# Altium project Main.PrjPcb
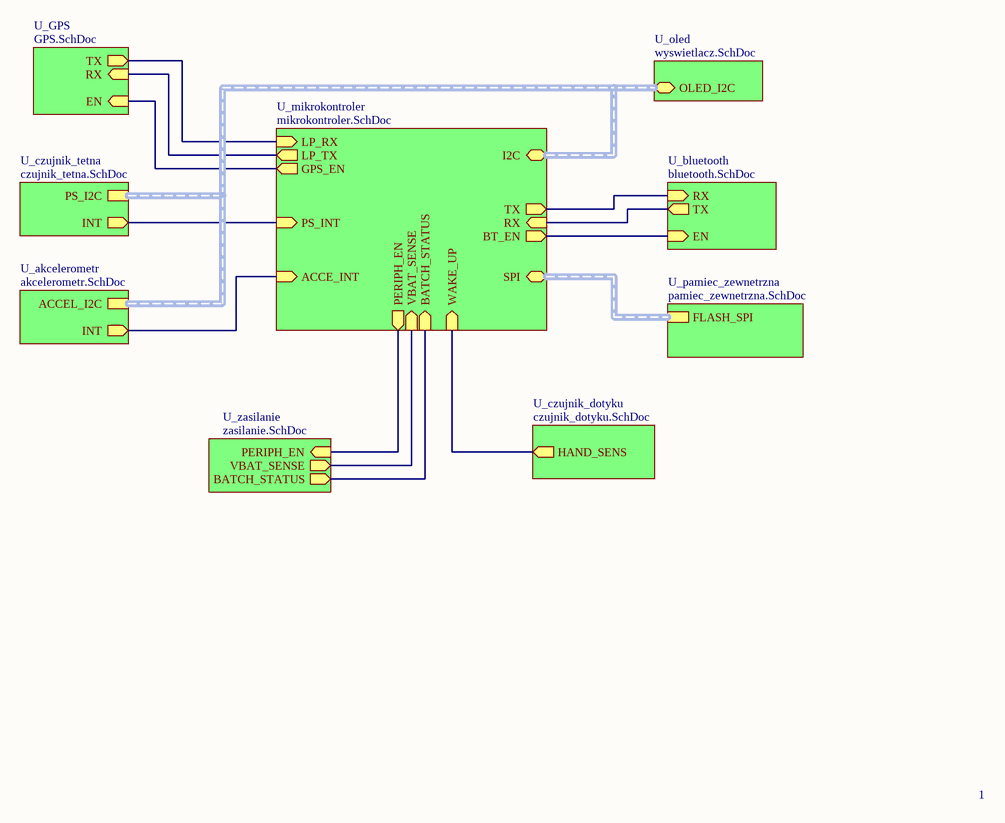
[diagram p0: schemat_blokowy.SchDoc]
ProjectAuthor: Grzegorz Œwistak
10 sheets, 51 parts. Net scope: hierarchical (ports join the sheet entries above them; power ports are global).
Board file: board.PcbDoc
Sheets:
  schemat_blokowy.SchDoc
    U_bluetooth = bluetooth.SchDoc
    U_czujnik_tetna = czujnik_tetna.SchDoc
    U_akcelerometr = akcelerometr.SchDoc
    U_pamiec_zewnetrzna = pamiec_zewnetrzna.SchDoc
    U_czujnik_dotyku = czujnik_dotyku.SchDoc
    U_zasilanie = zasilanie.SchDoc
    U_mikrokontroler = mikrokontroler.SchDoc
    U_GPS = GPS.SchDoc
    U_oled = wyswietlacz.SchDoc

## Sheet schemat_blokowy.SchDoc: Block diagram
size A4

### Sub-sheets
U_akcelerometr = akcelerometr.SchDoc: ACCEL_I2C (harness I2C), INT (out)
U_bluetooth = bluetooth.SchDoc: TX (out), RX (in), EN (in)
U_czujnik_dotyku = czujnik_dotyku.SchDoc: HAND_SENS (out)
U_czujnik_tetna = czujnik_tetna.SchDoc: PS_I2C (harness I2C), INT (out)
U_GPS = GPS.SchDoc: RX (in), TX (out), EN (in)
U_mikrokontroler = mikrokontroler.SchDoc: SPI (harness SPI), I2C (harness I2C), ACCE_INT (in), WAKE_UP (in), LP_TX (out), LP_RX (in), TX (out), RX (in), PS_INT (in), BT_EN (out), GPS_EN (out), PERIPH_EN (out), VBAT_SENSE (in), BATCH_STATUS (in)
U_oled = wyswietlacz.SchDoc: OLED_I2C (harness I2C)
U_pamiec_zewnetrzna = pamiec_zewnetrzna.SchDoc: FLASH_SPI (harness SPI)
U_zasilanie = zasilanie.SchDoc: PERIPH_EN (in), VBAT_SENSE (out), BATCH_STATUS (out)

### Nets
NetC12_2: sheet U_zasilanie/VBAT_SENSE, sheet U_mikrokontroler/VBAT_SENSE
NetIC1_13: sheet U_czujnik_tetna/INT, sheet U_mikrokontroler/PS_INT
NetIC2_1: sheet U_czujnik_dotyku/HAND_SENS, sheet U_mikrokontroler/WAKE_UP
NetIC3_20: sheet U_mikrokontroler/LP_RX, sheet U_GPS/TX
NetIC3_21: sheet U_mikrokontroler/LP_TX, sheet U_GPS/RX
NetIC5_1: sheet U_zasilanie/BATCH_STATUS, sheet U_mikrokontroler/BATCH_STATUS
NetIC8_7: sheet U_mikrokontroler/GPS_EN, sheet U_GPS/EN
NetIC8_15: sheet U_akcelerometr/INT, sheet U_mikrokontroler/ACCE_INT
NetIC8_22: sheet U_zasilanie/PERIPH_EN, sheet U_mikrokontroler/PERIPH_EN
NetIC8_26: sheet U_bluetooth/EN, sheet U_mikrokontroler/BT_EN
NetIC8_29: sheet U_bluetooth/RX, sheet U_mikrokontroler/TX
NetIC8_30: sheet U_bluetooth/TX, sheet U_mikrokontroler/RX

### Buses and harness runs
harness sheet U_akcelerometr/ACCEL_I2C = sheet U_czujnik_tetna/PS_I2C = sheet U_mikrokontroler/I2C = sheet U_oled/OLED_I2C
harness sheet U_mikrokontroler/SPI = sheet U_pamiec_zewnetrzna/FLASH_SPI

### Notes on the sheet
- 1

## Sheet bluetooth.SchDoc: Bluetooth
size A4
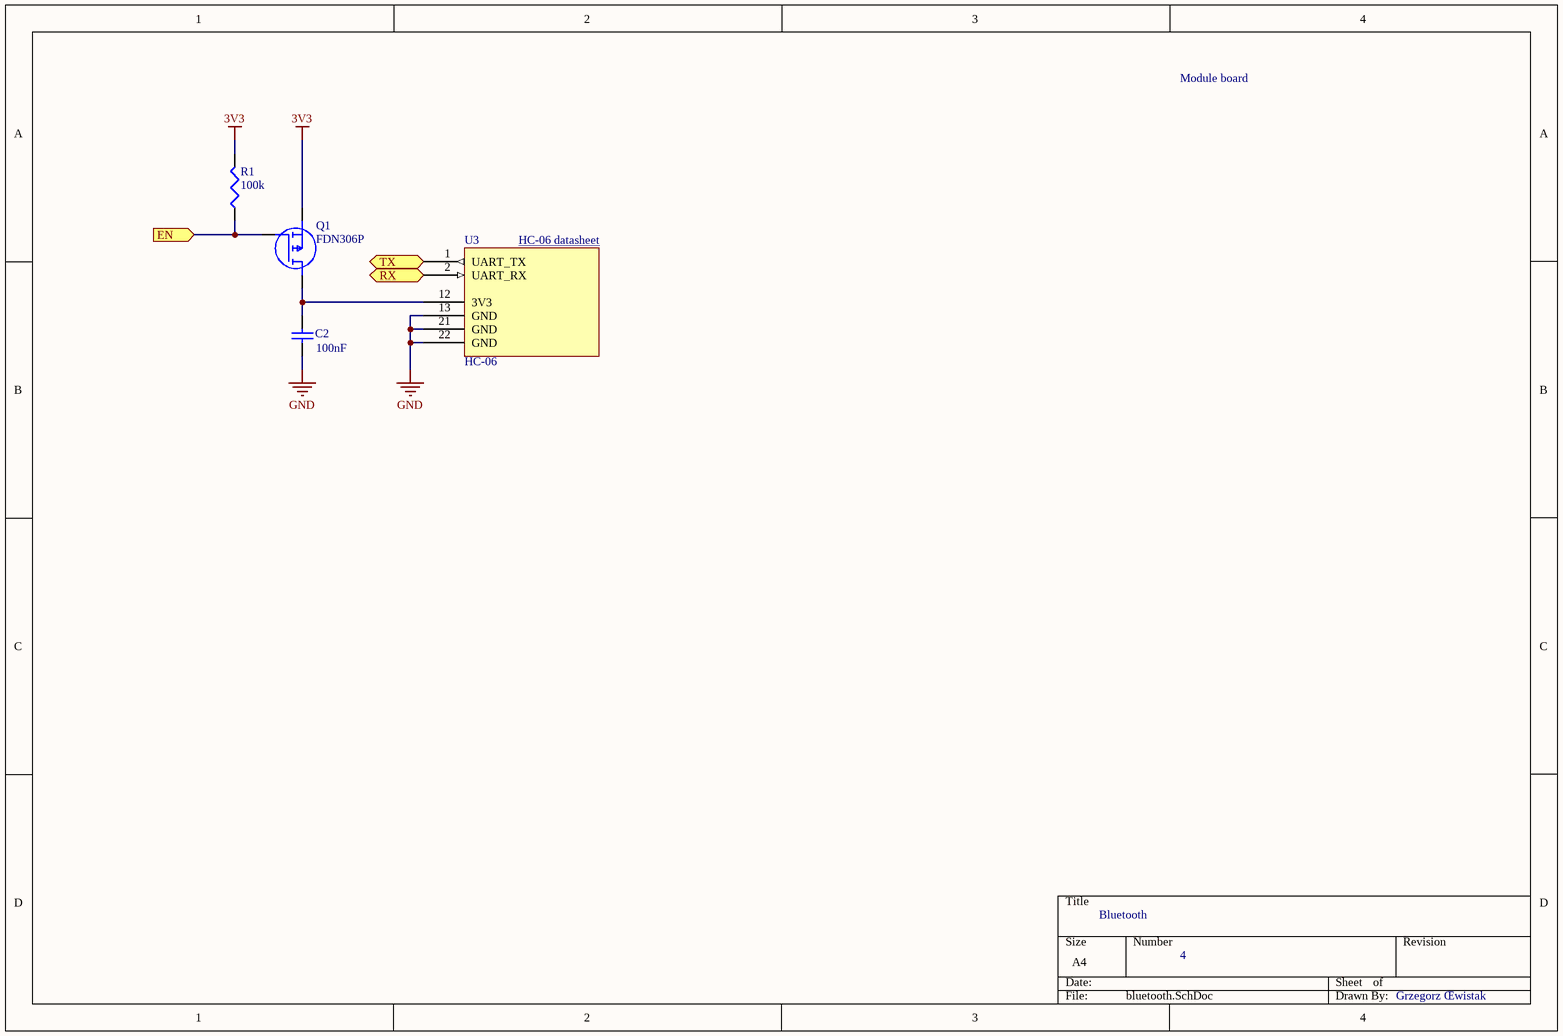
[diagram p1: bluetooth.SchDoc]

### Parts
C2  value 100nF  [C0805]  (hidden comment: Cap)
Q1  FDN306P  [SOT95P237X112-3N]
R1  value 100k  [R0603]  (hidden comment: Res3)
U3  HC-06  [HC-06_footprint_minimal_pin_number]

### Ports
EN (in), RX (in), TX (out)

### Nets
3V3: Q1.2(S) R1.2
GND: C2.1 U3.13(GND) U3.21(GND) U3.22(GND)
NetC2_2: C2.2 Q1.3(D) U3.12(3V3)
NetIC8_26: Q1.1(G) R1.1 ; port EN
NetIC8_29: U3.2(UART_RX) ; port RX
NetIC8_30: U3.1(UART_TX) ; port TX

### Notes on the sheet
- Module board
- HC-06 datasheet <https://www.olimex.com/Products/Components/RF/BLUETOOTH-SERIAL-HC-06/resources/hc06.pdf>
- 4

### Library data of the parts
C2 = Cap: Capacitor; Published: 8-Jun-2000; LatestRevisionDate: 17-Jul-2002; LatestRevisionNote: Re-released for DXP Platform.; PackageReference: RAD-0.3; Publisher: Altium Limited; PackageDescription: Radial Cap, Thru-Hole; 2 Leads; 0.3 in Pin Spacing
Q1 = FDN306P: MOSFET (P-Channel); Manufacturer_Name: ON Semiconductor; Datasheet Link: http://uk.rs-online.com/web/p/products/1241702; Height: 1.12mm; Manufacturer_Part_Number: FDN306P; Arrow Part Number: FDN306P; Arrow Price/Stock: https://www.arrow.com/en/products/fdn306p/on-semiconductor; Mouser Part Number: 512-FDN306P; Mouser Price/Stock: https://www.mouser.co.uk/ProductDetail/ON-Semiconductor-Fairchild/FDN306P?qs=GeD7q9OHBPy9Kkc110idSQ%3D%3D
R1 = Res3: Resistor; Published: 8-Jun-2000; LatestRevisionDate: 29-May-2009; LatestRevisionNote: IPC-7351 Footprint Added.; PackageReference: J1-0603; Publisher: Altium Limited; PackageDescription: Chip Resistor
U3 = HC-06: HC-06 bluetooth module

## Sheet czujnik_tetna.SchDoc: Czujnik tętna
size A4; DrawnBy: Grzegorz Świstak; SheetNumber: 1
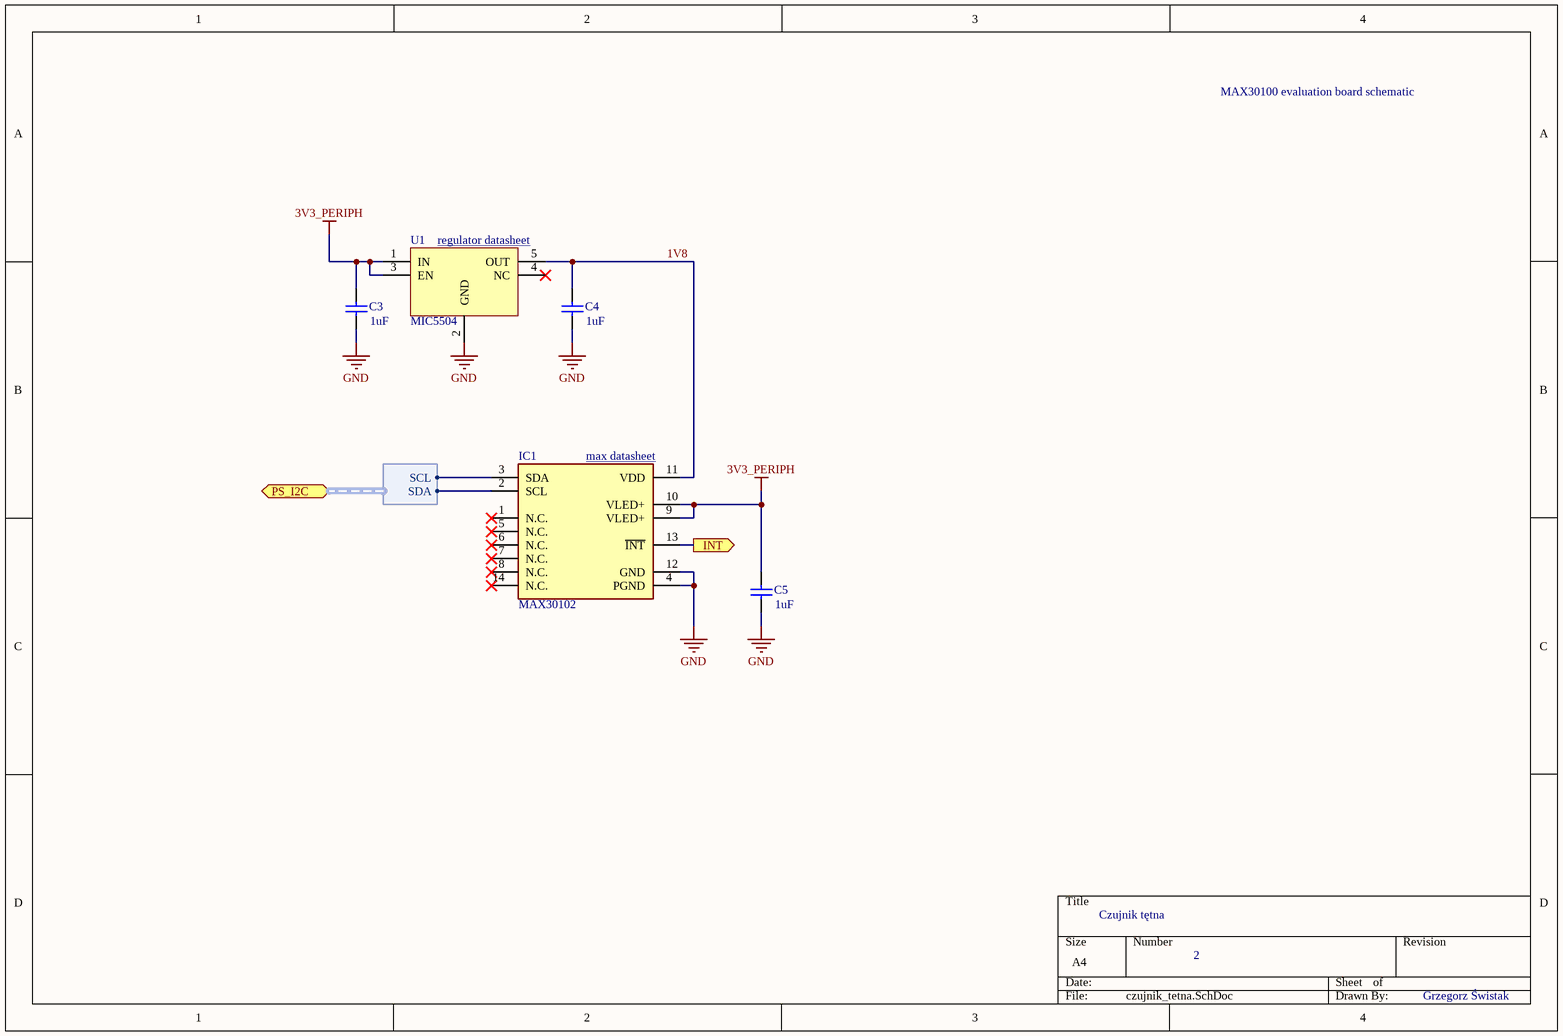
[diagram p2: czujnik_tetna.SchDoc]

### Parts
C3  value 1uF  [cap-0603]  (hidden comment: Cap)
C4  value 1uF  [cap-0603]  (hidden comment: Cap)
C5  value 1uF  [cap-0603]  (hidden comment: Cap)
IC1  MAX30102  [MAX30102EFDT]
U1  MIC5504  [SOT23-5]

### Ports
INT (out), PS_I2C (harness I2C)

### Harnesses
I2C: SDA, SCL

### Nets
3V3_PERIPH: C3.2 C5.2 IC1.9(VLED+) IC1.10(VLED+) U1.1(IN) U1.3(EN)
GND: C3.1 C4.1 C5.1 IC1.4(PGND) IC1.12(GND) U1.2(GND)
1V8: C4.2 IC1.11(VDD) U1.5(OUT)
I2C.SCL: IC1.3(SDA) ; port PS_I2C.SCL
I2C.SDA: IC1.2(SCL) ; port PS_I2C.SDA
NetIC1_13: IC1.13(~{INT}) ; port INT

Not connected (* = marked no-connect by the designer): IC1 1(N.C.)* 5(N.C.)* 6(N.C.)* 7(N.C.)* 8(N.C.)* 14(N.C.)*; U1 4(NC)*

### Notes on the sheet
- MAX30100 evaluation board schematic
- (near U1) regulator datasheet <http://ww1.microchip.com/downloads/en/DeviceDoc/MIC5501-02-03-04-300mA-Single-Output-LDO-in-Small-Packages-DS20006006B.pdf>
- (near IC1) max datasheet <https://datasheets.maximintegrated.com/en/ds/MAX30102.pdf>
- 2

### Library data of the parts
C3-C5 = Cap: Capacitor; Published: 8-Jun-2000; LatestRevisionDate: 17-Jul-2002; LatestRevisionNote: Re-released for DXP Platform.; PackageReference: RAD-0.3; Publisher: Altium Limited; PackageDescription: Radial Cap, Thru-Hole; 2 Leads; 0.3 in Pin Spacing
IC1 = MAX30102EFD+T: https://datasheets.maximintegrated.com/en/ds/MAX30102.pdf; Datasheet Link: https://datasheets.maximintegrated.com/en/ds/MAX30102.pdf; Height: 1.65mm; Manufacturer_Name: Maxim Integrated; Manufacturer_Part_Number: MAX30102EFD+T; Arrow Part Number: MAX30102EFD+T; Mouser Part Number: 700-MAX30102EFD+T; Mouser Price/Stock: https://www.mouser.co.uk/ProductDetail/Maxim-Integrated/MAX30102EFD%2bT?qs=nVS1qgv%252BQrkHA4%2FoFYriFA%3D%3D
U1 = MIC5504: http://ww1.microchip.com/downloads/en/DeviceDoc/21813F.pdf

## Sheet akcelerometr.SchDoc: Akcelerometer
size A4
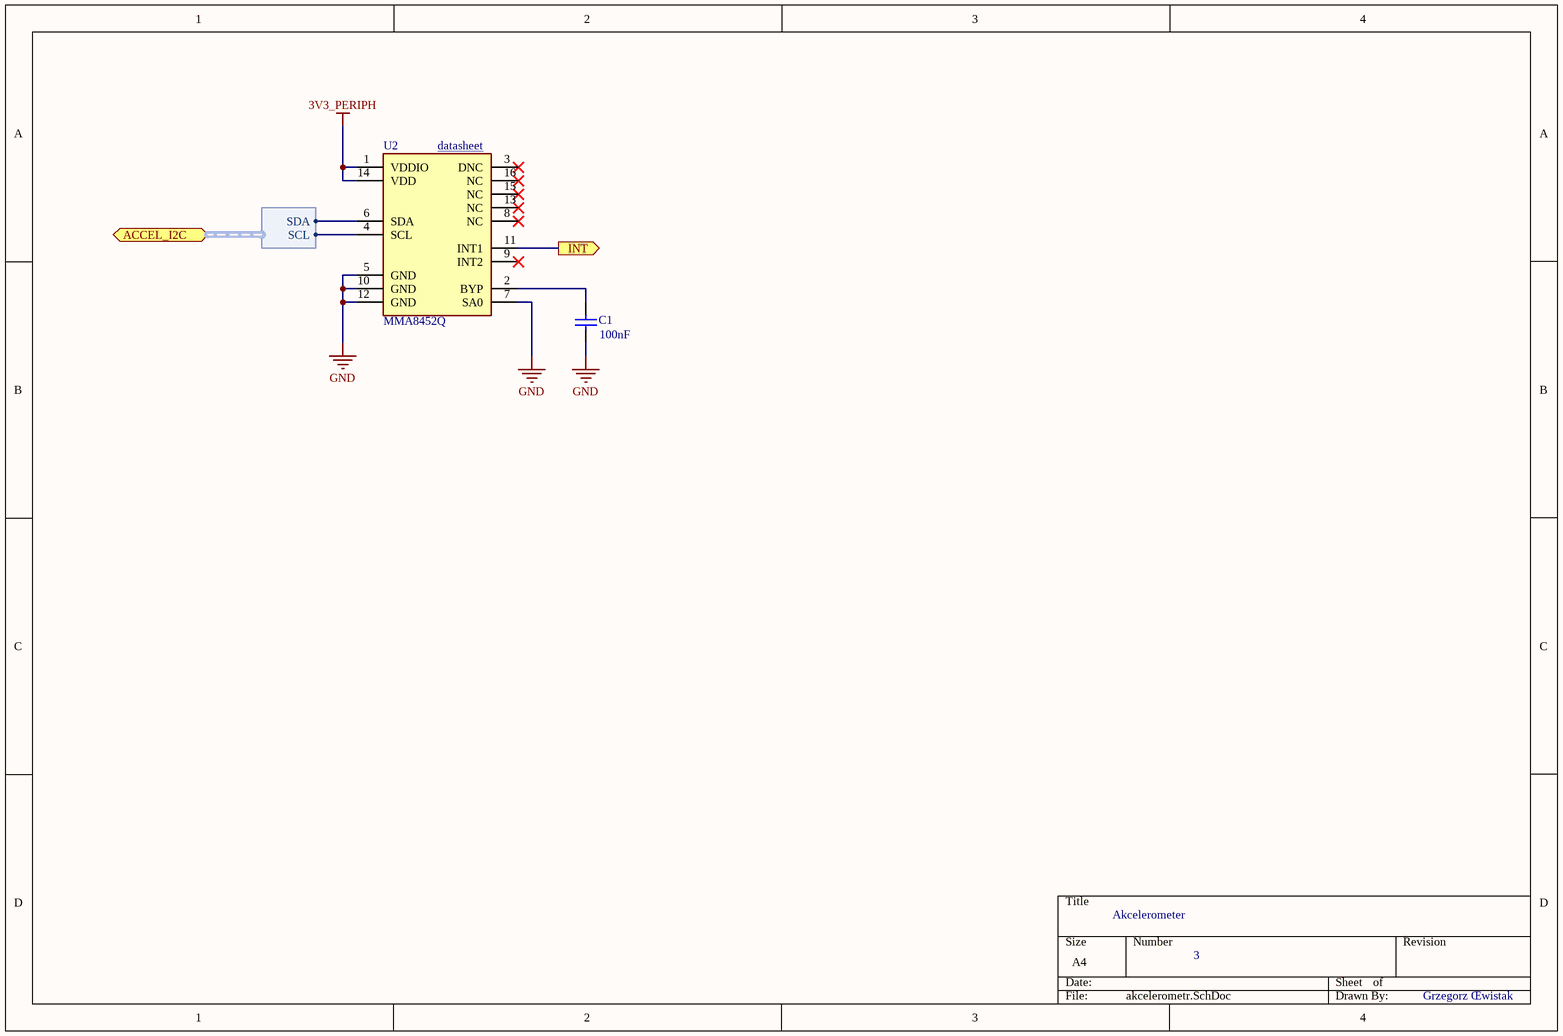
[diagram p3: akcelerometr.SchDoc]

### Parts
C1  value 100nF  [C0805]  (hidden comment: Cap)
U2  MMA8452Q  [QFN-16]

### Ports
ACCEL_I2C (harness I2C), INT (out)

### Harnesses
I2C: SDA, SCL

### Nets
3V3_PERIPH: U2.1(VDDIO) U2.14(VDD)
GND: C1.1 U2.5(GND) U2.7(SA0) U2.10(GND) U2.12(GND)
I2C.SCL: U2.4(SCL) ; port ACCEL_I2C.SCL
I2C.SDA: U2.6(SDA) ; port ACCEL_I2C.SDA
NetC1_2: C1.2 U2.2(BYP)
NetIC8_15: U2.11(INT1) ; port INT

Not connected (* = marked no-connect by the designer): U2 3(DNC)* 8(NC)* 9(INT2)* 13(NC)* 15(NC)* 16(NC)*

### Notes on the sheet
- (near U2) datasheet <https://www.tme.eu/Document/9ec5aa089751e59cf0a8343add08639a/MMA8452Q.pdf>
- 3

### Library data of the parts
C1 = Cap: Capacitor; Published: 8-Jun-2000; LatestRevisionDate: 17-Jul-2002; LatestRevisionNote: Re-released for DXP Platform.; PackageReference: RAD-0.3; Publisher: Altium Limited; PackageDescription: Radial Cap, Thru-Hole; 2 Leads; 0.3 in Pin Spacing
U2 = MMA8452QR1: Accelerometer; Manufacturer_Name: NXP; Datasheet Link: http://www.nxp.com/docs/en/data-sheet/MMA8452Q.pdf; Height: 1mm; Manufacturer_Part_Number: MMA8452QR1; Arrow Part Number: MMA8452QR1; Arrow Price/Stock: https://www.arrow.com/en/products/mma8452qr1/nxp-semiconductors; Mouser Part Number: 841-MMA8452QR1; Mouser Price/Stock: https://www.mouser.co.uk/ProductDetail/NXP-Semiconductors/MMA8452QR1?qs=nf24X8JpkflP9lEXYucw7A%3D%3D

## Sheet pamiec_zewnetrzna.SchDoc: Flash memory
size A4
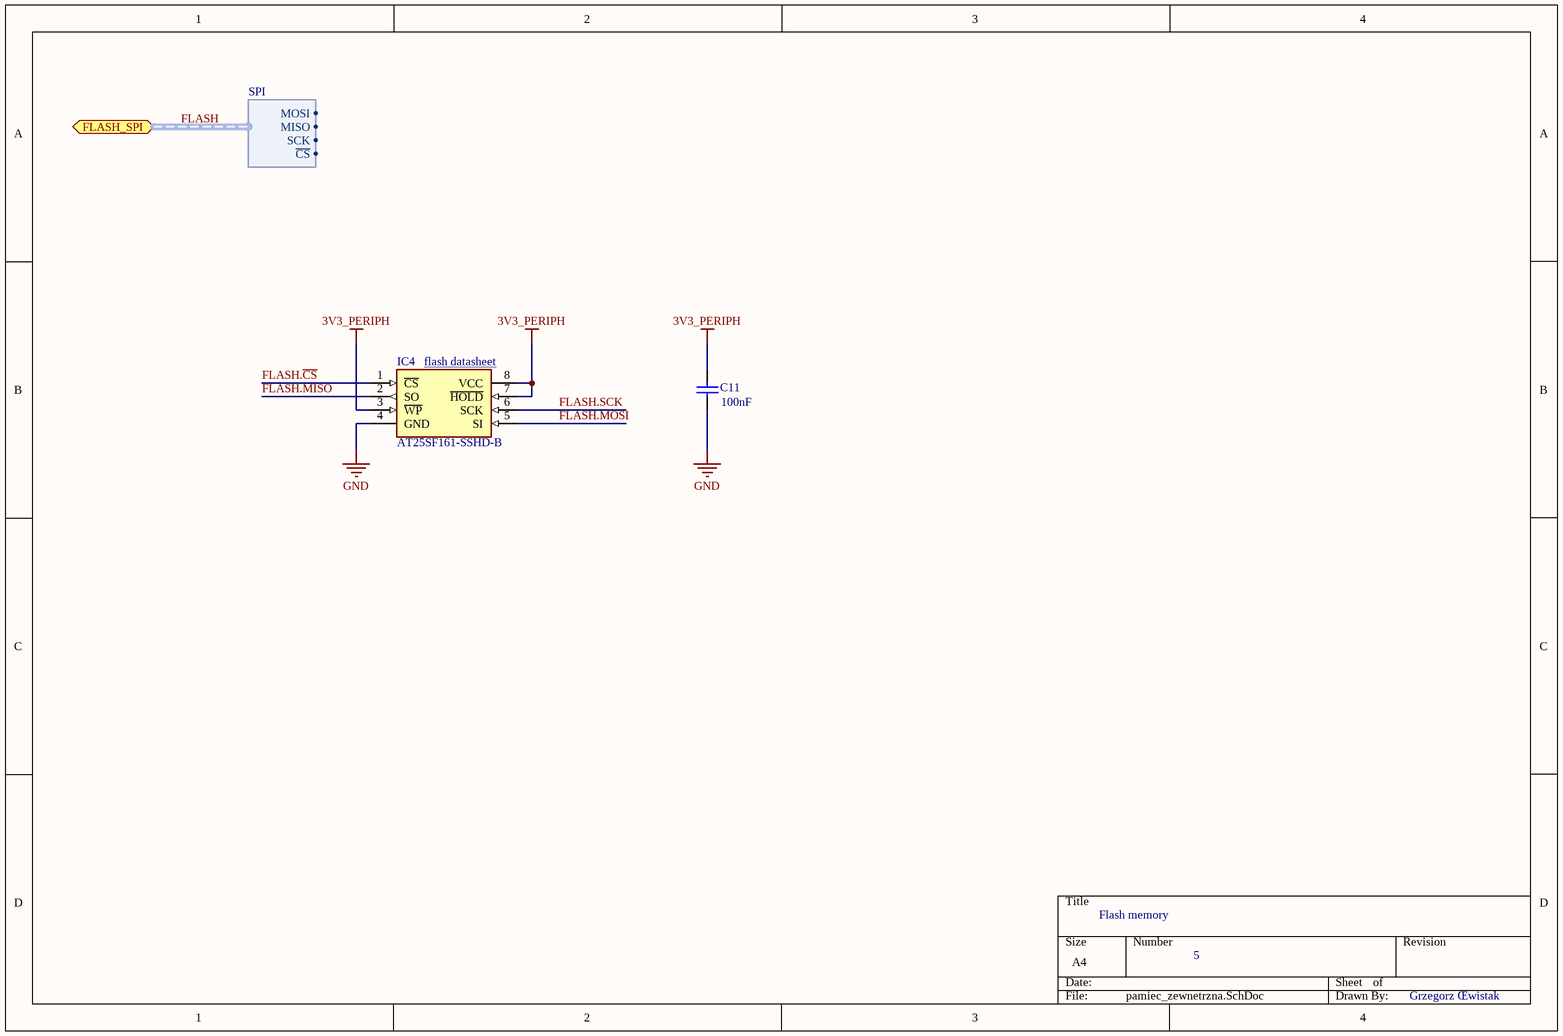
[diagram p4: pamiec_zewnetrzna.SchDoc]

### Parts
C11  value 100nF  [C0805]  (hidden comment: Cap)
IC4  AT25SF161-SSHD-B  [SOIC127P600X175-8N]

### Ports
FLASH_SPI (harness SPI)

### Harnesses
SPI: MOSI, MISO, SCK, ~{CS}

### Nets
3V3_PERIPH: C11.2 IC4.3(~{WP}) IC4.7(~{HOLD}) IC4.8(VCC)
GND: C11.1 IC4.4(GND)
FLASH.~{CS}: IC4.1(~{CS})
FLASH.MISO: IC4.2(SO)
FLASH.MOSI: IC4.5(SI)
FLASH.SCK: IC4.6(SCK)

### Buses and harness runs
harness FLASH = port FLASH_SPI

### Notes on the sheet
- (near IC4) flash datasheet <https://www.adestotech.com/wp-content/uploads/DS-AT25SF081_045.pdf>
- 5

### Library data of the parts
C11 = Cap: Capacitor; Published: 8-Jun-2000; LatestRevisionDate: 17-Jul-2002; LatestRevisionNote: Re-released for DXP Platform.; PackageReference: RAD-0.3; Publisher: Altium Limited; PackageDescription: Radial Cap, Thru-Hole; 2 Leads; 0.3 in Pin Spacing
IC4 = AT25SF081-SSHD-B: flash memory SPI; Manufacturer_Name: Adesto Technologies; Datasheet Link: https://www.mouser.com/datasheet/2/590/DS-AT25SF081_045-1385733.pdf; Height: 1.75mm; Manufacturer_Part_Number: AT25SF081-SSHD-B; Arrow Part Number: AT25SF081-SSHD-B; Arrow Price/Stock: https://www.arrow.com/en/products/at25sf081-sshd-b/adesto-technologies-corporation-inc; Mouser Part Number: 988-AT25SF081-SSHD-B; Mouser Price/Stock: https://www.mouser.com/Search/Refine.aspx?Keyword=988-AT25SF081-SSHD-B

## Sheet czujnik_dotyku.SchDoc: Touch sensor
size A4
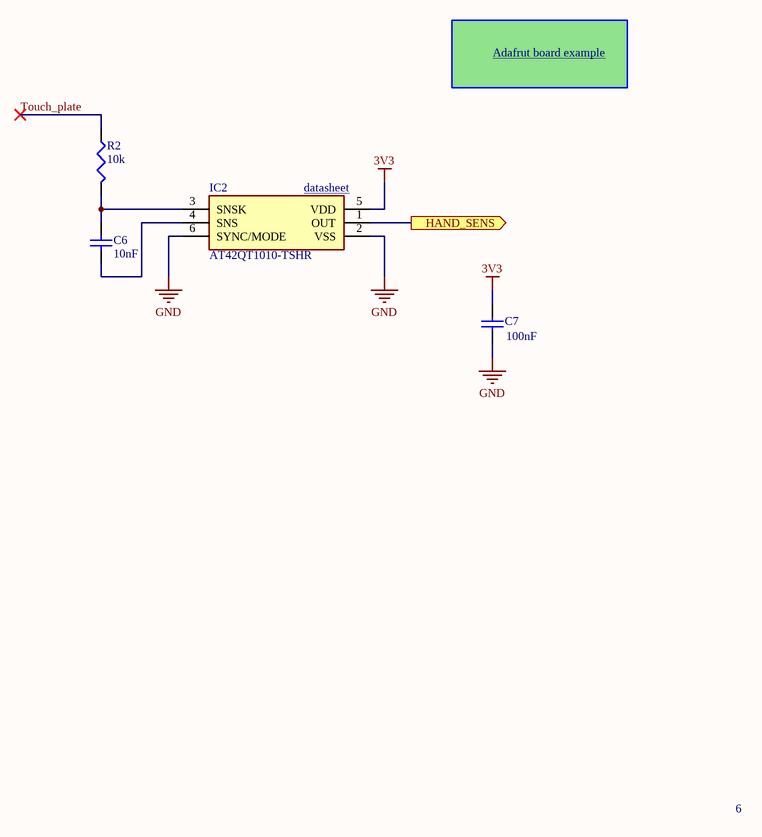
[diagram p5: czujnik_dotyku.SchDoc]

### Parts
C6  value 10nF  [C0805]  (hidden comment: Cap)
C7  value 100nF  [C0805]  (hidden comment: Cap)
IC2  AT42QT1010-TSHR  [SOT95P280X145-6N]
R2  value 10k  [R0603]  (hidden comment: Res3)

### Ports
HAND_SENS (out)

### Nets
3V3: C7.2 IC2.5(VDD)
GND: C7.1 IC2.2(VSS) IC2.6(SYNC/MODE)
Touch_plate: R2.2
NetC6_1: C6.1 IC2.4(SNS)
NetC6_2: C6.2 IC2.3(SNSK) R2.1
NetIC2_1: IC2.1(OUT) ; port HAND_SENS

### Notes on the sheet
- Adafrut board example <https://learn.adafruit.com/adafruit-capacitive-touch-sensor-breakouts/downloads>
- (near IC2) datasheet <https://cdn-shop.adafruit.com/datasheets/AT42QT1010.pdf>
- 6

### Library data of the parts
C6 C7 = Cap: Capacitor; Published: 8-Jun-2000; LatestRevisionDate: 17-Jul-2002; LatestRevisionNote: Re-released for DXP Platform.; PackageReference: RAD-0.3; Publisher: Altium Limited; PackageDescription: Radial Cap, Thru-Hole; 2 Leads; 0.3 in Pin Spacing
IC2 = AT42QT1010-TSHR: capacitive touch sensor; Manufacturer_Name: Microchip; Datasheet Link: http://www.atmel.com/images/atmel-9541-at42-qtouch-bsw-at42qt1010_datasheet.pdf; Height: 1.45mm; Manufacturer_Part_Number: AT42QT1010-TSHR; Arrow Part Number: AT42QT1010-TSHR; Arrow Price/Stock: https://www.arrow.com/en/products/at42qt1010-tshr/microchip-technology; Mouser Part Number: 556-AT42QT1010-TSHR; Mouser Price/Stock: https://www.mouser.co.uk/ProductDetail/Microchip-Technology/AT42QT1010-TSHR?qs=xbJoyvfFV%2F%252BFK88JVR2efg%3D%3D
R2 = Res3: Resistor; Published: 8-Jun-2000; LatestRevisionDate: 29-May-2009; LatestRevisionNote: IPC-7351 Footprint Added.; PackageReference: J1-0603; Publisher: Altium Limited; PackageDescription: Chip Resistor

## Sheet zasilanie.SchDoc: Power supply
size A4
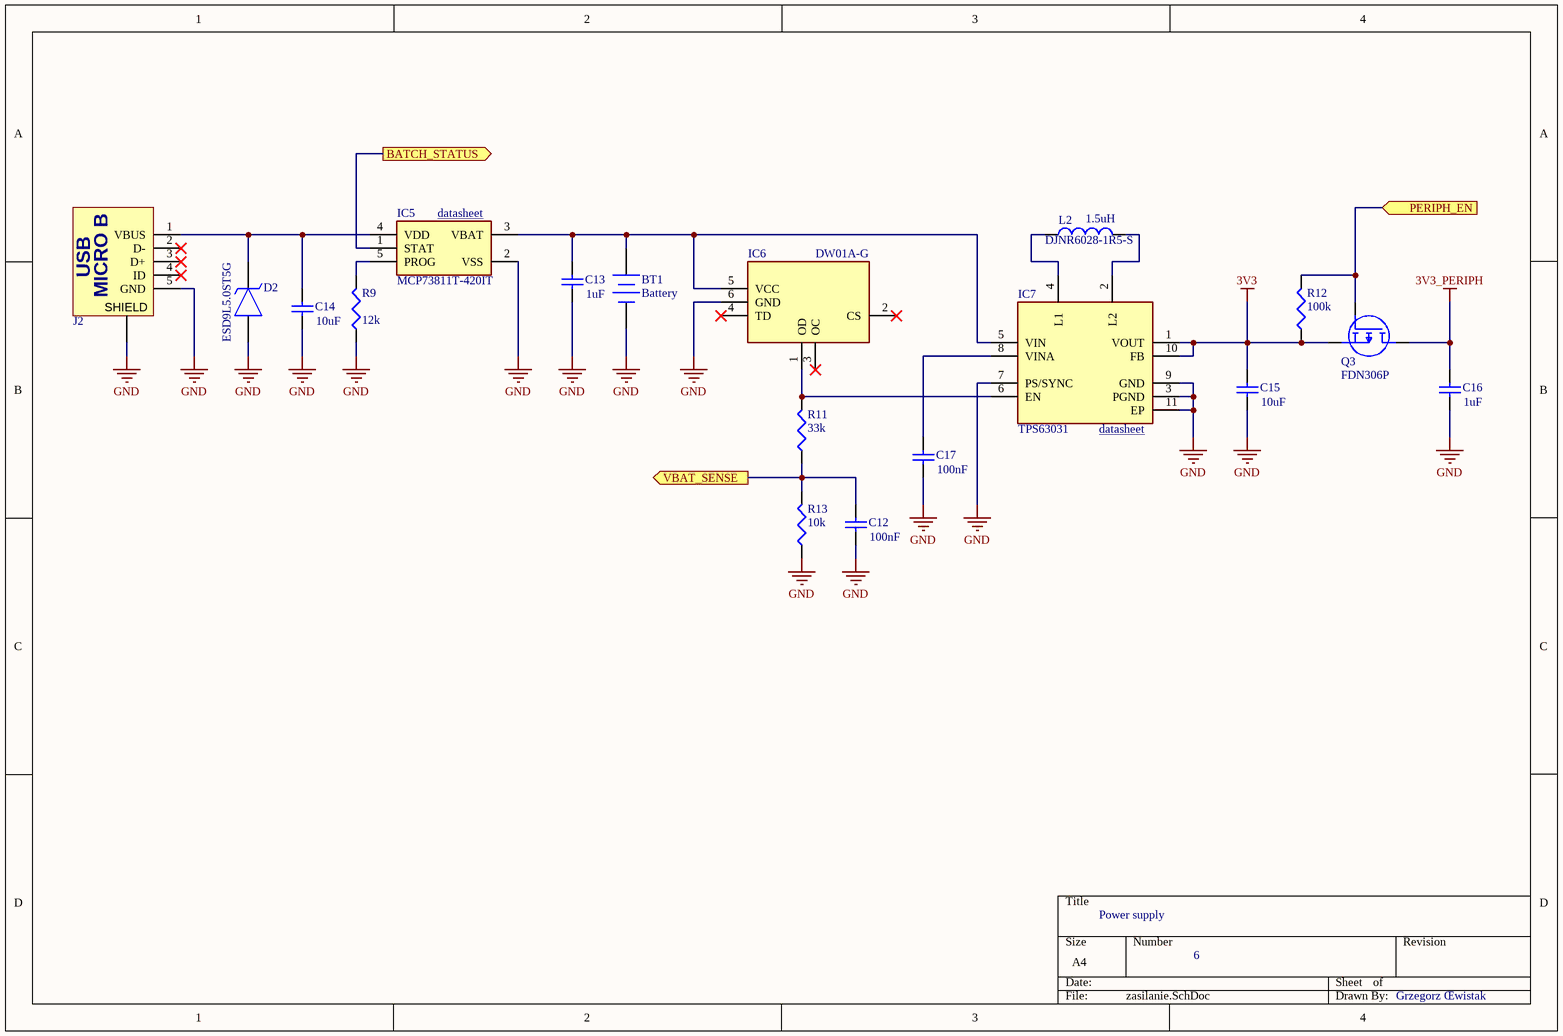
[diagram p6: zasilanie.SchDoc]

### Parts
BT1  Battery  [BAT_PAD]
C12  value 100nF  [C0805]  (hidden comment: Cap)
C13  value 1uF  [cap-0603]  (hidden comment: Cap)
C14  value 10uF  [cap-0603]  (hidden comment: Cap)
C15  value 10uF  [cap-0603]  (hidden comment: Cap)
C16  value 1uF  [cap-0603]  (hidden comment: Cap)
C17  value 100nF  [C0805]  (hidden comment: Cap)
D2  ESD9L5.0ST5G  [SODFL1006X40N]
IC5  MCP73811T-420IT  [SOT95P270X145-5N]
IC6  DW01A-G  [SOT95P280X135-6N]
IC7  TPS63031  [SON50P250X250X80-11N-D]
J2  Micro USB  [101181930001LF]  (value not drawn)
L2  DJNR6028-1R5-S  value 1.5uH  [DJNR6028-1R5-S]
Q3  FDN306P  [SOT95P237X112-3N]
R9  value 12k  [R0603]  (hidden comment: Res3)
R11  value 33k  [R0603]  (hidden comment: Res3)
R12  value 100k  [R0603]  (hidden comment: Res3)
R13  value 10k  [R0603]  (hidden comment: Res3)

### Ports
BATCH_STATUS (out), PERIPH_EN (in), VBAT_SENSE (out)

### Nets
3V3: C15.2 IC7.1(VOUT) IC7.10(FB) Q3.2(S) R12.2
3V3_PERIPH: C16.2 Q3.3(D)
GND: BT1.2(-) C12.1 C13.1 C14.1 C15.1 C16.1 C17.1 D2.2(A) IC5.2(VSS) IC6.6(GND) IC7.3(PGND) IC7.7(PS/SYNC) IC7.9(GND) IC7.11(EP) J2.5(GND) J2.6(SHIELD) R9.1 R13.2
NetBT1_1: BT1.1(+) C13.2 IC5.3(VBAT) IC6.5(VCC) IC7.5(VIN)
NetC12_2: C12.2 R11.2 R13.1 ; port VBAT_SENSE
NetC14_2: C14.2 D2.1(K) IC5.4(VDD) J2.1(VBUS)
NetC17_2: C17.2 IC7.8(VINA)
NetIC5_1: IC5.1(STAT) ; port BATCH_STATUS
NetIC5_5: IC5.5(PROG) R9.2
NetIC6_1: IC6.1(OD) IC7.6(EN) R11.1
NetIC7_2: IC7.2(L2) L2.2
NetIC7_4: IC7.4(L1) L2.1
NetIC8_22: Q3.1(G) R12.1 ; port PERIPH_EN

Not connected (* = marked no-connect by the designer): IC6 2(CS)* 3(OC)* 4(TD)*; J2 2(D-)* 3(D+)* 4(ID)*

### Notes on the sheet
- (near IC5) datasheet <http://ww1.microchip.com/downloads/en/DeviceDoc/MCP73831-Family-Data-Sheet-DS20001984H.pdf>
- (near IC7) datasheet <https://www.ti.com/lit/ds/slvs696d/slvs696d.pdf?ts=1594227141854&ref_url=https%253A%252F%252Fwww.google.com%252F>
- 6
- (in symbol USB-10118193-0001LF) USB; MICRO B

### Library data of the parts
BT1 = Battery: Multicell Battery; Published: 24-Mar-1999; LatestRevisionDate: 17-Jul-2002; LatestRevisionNote: Re-released for DXP Platform.; PackageReference: BAT-2; Publisher: Altium Limited; PackageDescription: Battery; 2 Leads
C12-C17 = Cap: Capacitor; Published: 8-Jun-2000; LatestRevisionDate: 17-Jul-2002; LatestRevisionNote: Re-released for DXP Platform.; PackageReference: RAD-0.3; Publisher: Altium Limited; PackageDescription: Radial Cap, Thru-Hole; 2 Leads; 0.3 in Pin Spacing
D2 = ESD9L5.0ST5G: Transil; Manufacturer_Name: ON Semiconductor; Datasheet Link: http://www.onsemi.com/pub/Collateral/ESD9L-D.PDF; Height: 0.4mm; Manufacturer_Part_Number: ESD9L5.0ST5G; Arrow Part Number: ESD9L5.0ST5G; Arrow Price/Stock: https://www.arrow.com/en/products/esd9l5.0st5g/on-semiconductor; Mouser Part Number: 863-ESD9L5.0ST5G; Mouser Price/Stock: https://www.mouser.co.uk/ProductDetail/ON-Semiconductor/ESD9L50ST5G?qs=lq5%252BOP7PS0%252BtbEEODUxZiA%3D%3D
IC5 = MCP73831T: Integrated Circuit; Manufacturer_Name: Microchip; Manufacturer_Part_Number: MCP73831T-5ACI/OT; Datasheet Link: http://www.microchip.com/mymicrochip/filehandler.aspx?ddocname=en025112; Height: 1.45mm; Arrow Part Number: MCP73831T-5ACI/OT; Arrow Price/Stock: https://www.arrow.com/en/products/mcp73831t-5aciot/microchip-technology; Mouser Part Number: 579-MCP73831T5ACIOT; Mouser Price/Stock: https://www.mouser.co.uk/ProductDetail/Microchip-Technology/MCP73831T-5ACI-OT?qs=hH%252BOa0VZEiAcgAcEkuamXg%3D%3D
IC6 = DW01A-G: Integrated Circuit; Manufacturer_Name: Fortune Semiconductor Corporation; Datasheet Link: http://acoptex.com/uploads/DW01A.pdf; Height: 1.35mm; Manufacturer_Part_Number: DW01A-G; Arrow Part Number: DW01A-G
IC7 = TPS63031DSKT: TPS63031 buck-boost 3v3; Manufacturer_Name: Texas Instruments; Datasheet Link: http://www.ti.com/lit/gpn/tps63031; Height: 0.8mm; Manufacturer_Part_Number: TPS63031DSKT; Arrow Part Number: TPS63031DSKT; Arrow Price/Stock: https://www.arrow.com/en/products/tps63031dskt/texas-instruments; Mouser Part Number: 595-TPS63031DSKT; Mouser Price/Stock: https://www.mouser.co.uk/ProductDetail/Texas-Instruments/TPS63031DSKT?qs=ptj1V1atRArBpxn4nGxMNw%3D%3D
J2 = USB-10118193-0001LF: model 10118193-0001LF amphenol; Datasheet Link: https://componentsearchengine.com/Datasheets/1/10118193-0001LF.pdf; Height: 3.1mm; Manufacturer_Name: Amphenol; Manufacturer_Part_Number: 10118193-0001LF; Arrow Part Number: 10118193-0001LF; Arrow Price/Stock: https://www.arrow.com/en/products/10118193-0001lf/amphenol-fci; Mouser Part Number: 649-10118193-0001LF; Mouser Price/Stock: https://www.mouser.co.uk/ProductDetail/Amphenol-FCI/10118193-0001LF?qs=Ywefl8B65e63Nsqd%252B8HZaQ%3D%3D
L2 = Inductor: Code_IEC: 1005; Published: 8-Jun-2000; LatestRevisionDate: 29-May-2009; LatestRevisionNote: IPC-7351 Footprint Added.; PackageReference: 0402-A; Publisher: Altium Limited; PackageDescription: Chip Inductor; Code_JEITA: 0402
Q3 = FDN306P: as Q1 on sheet bluetooth; Datasheet Link: http://uk.rs-online.com/web/p/products/1241702; Height: 1.12mm; Manufacturer_Part_Number: FDN306P; Arrow Part Number: FDN306P; Arrow Price/Stock: https://www.arrow.com/en/products/fdn306p/on-semiconductor; Mouser Part Number: 512-FDN306P; Mouser Price/Stock: https://www.mouser.co.uk/ProductDetail/ON-Semiconductor-Fairchild/FDN306P?qs=GeD7q9OHBPy9Kkc110idSQ%3D%3D
R9 R11-R13 = Res3: Resistor; Published: 8-Jun-2000; LatestRevisionDate: 29-May-2009; LatestRevisionNote: IPC-7351 Footprint Added.; PackageReference: J1-0603; Publisher: Altium Limited; PackageDescription: Chip Resistor

## Sheet mikrokontroler.SchDoc: Control unit
size A4
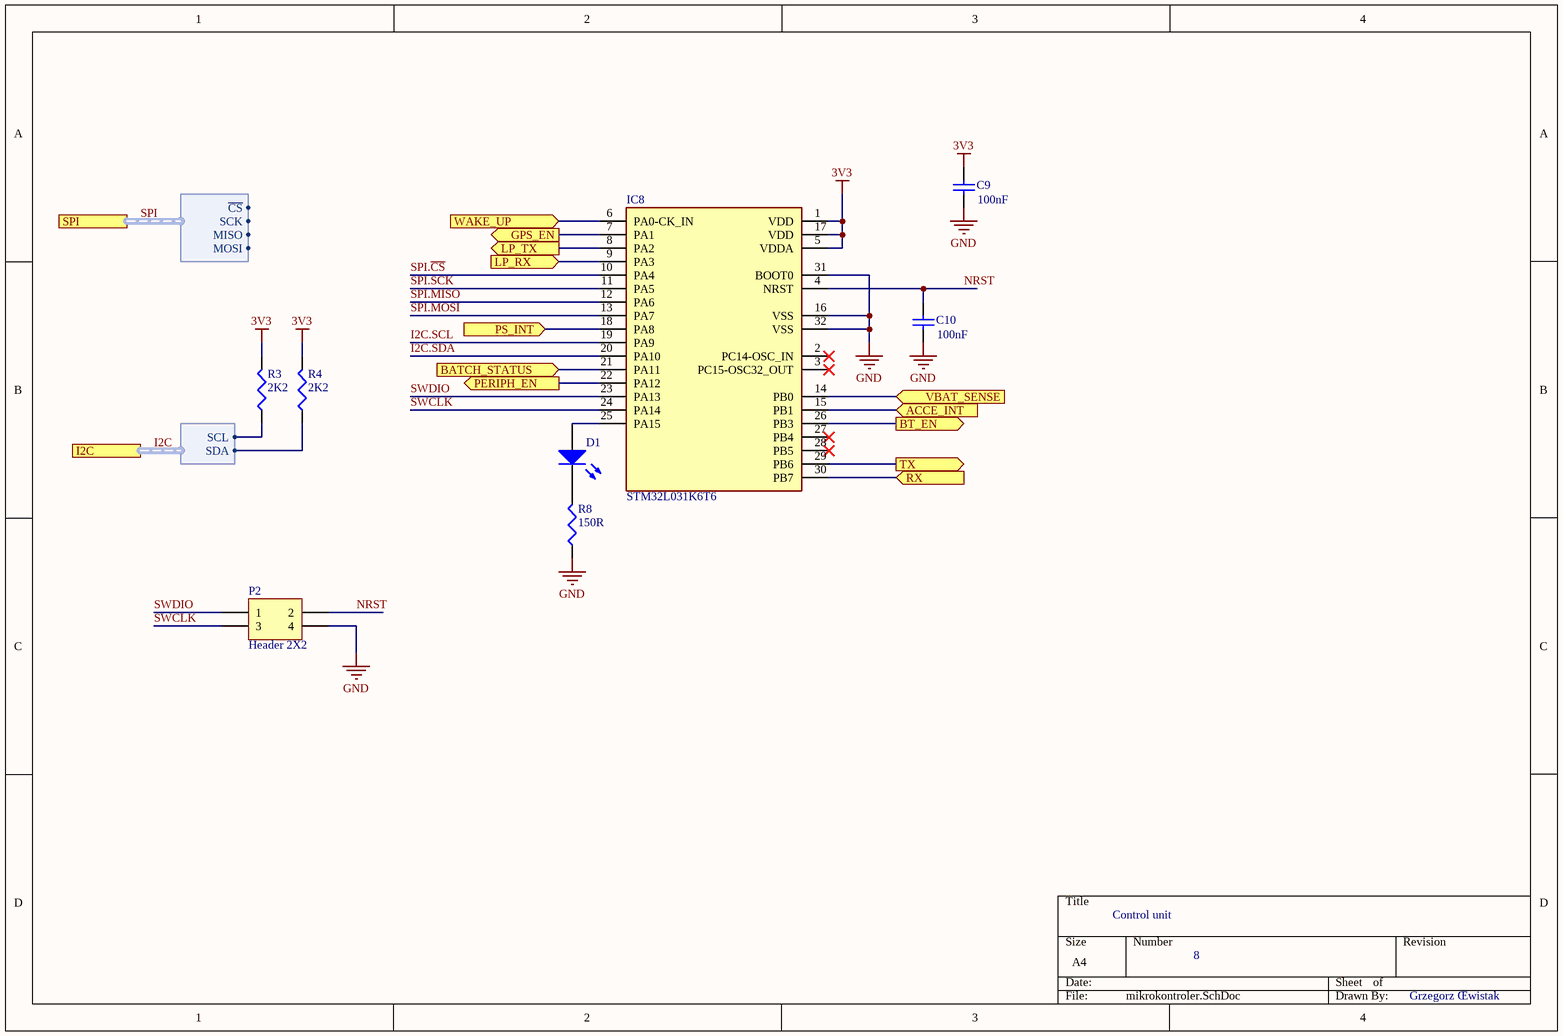
[diagram p7: mikrokontroler.SchDoc]

### Parts
C9  value 100nF  [C0805]  (hidden comment: Cap)
C10  value 100nF  [C0805]  (hidden comment: Cap)
D1  LL-S192PUAC-2A  [LED_0603]  (value not drawn)
IC8  STM32L031K6T6  [QFP80P900X900X160-32N]
P2  Header 2X2  [2x2_header]
R3  value 2K2  [R0603]  (hidden comment: Res3)
R4  value 2K2  [R0603]  (hidden comment: Res3)
R8  value 150R  [R0603]  (hidden comment: Res3)

### Ports
ACCE_INT (in), BATCH_STATUS (in), BT_EN (out), GPS_EN (out), I2C (harness I2C), LP_RX (in), LP_TX (out), PERIPH_EN (out), PS_INT (in), RX (in), SPI (harness SPI), TX (out), VBAT_SENSE (in), WAKE_UP (in)

### Harnesses
SPI: MOSI, MISO, SCK, ~{CS}
I2C: SCL, SDA

### Nets
3V3: C9.2 IC8.1(VDD) IC8.5(VDDA) IC8.17(VDD) R3.2 R4.2
GND: C9.1 C10.1 IC8.16(VSS) IC8.31(BOOT0) IC8.32(VSS) P2.4 R8.1
I2C.SCL: R3.1 ; port I2C.SCL
I2C.SCL: IC8.19(PA9)  [a separate net that carries the same name]
I2C.SDA: R4.1 ; port I2C.SDA
I2C.SDA: IC8.20(PA10)  [a separate net that carries the same name]
NRST: C10.2 IC8.4(NRST) P2.2
SPI.~{CS}: IC8.10(PA4)
SPI.MISO: IC8.12(PA6)
SPI.MOSI: IC8.13(PA7)
SPI.SCK: IC8.11(PA5)
SWCLK: IC8.24(PA14) P2.3
SWDIO: IC8.23(PA13) P2.1
NetC12_2: IC8.14(PB0) ; port VBAT_SENSE
NetD1_1: D1.1(A) IC8.25(PA15)
NetD1_2: D1.2(K) R8.2
NetIC1_13: IC8.18(PA8) ; port PS_INT
NetIC2_1: IC8.6(PA0-CK_IN) ; port WAKE_UP
NetIC3_20: IC8.9(PA3) ; port LP_RX
NetIC3_21: IC8.8(PA2) ; port LP_TX
NetIC5_1: IC8.21(PA11) ; port BATCH_STATUS
NetIC8_7: IC8.7(PA1) ; port GPS_EN
NetIC8_15: IC8.15(PB1) ; port ACCE_INT
NetIC8_22: IC8.22(PA12) ; port PERIPH_EN
NetIC8_26: IC8.26(PB3) ; port BT_EN
NetIC8_29: IC8.29(PB6) ; port TX
NetIC8_30: IC8.30(PB7) ; port RX

Not connected (* = marked no-connect by the designer): IC8 2(PC14-OSC_IN)* 3(PC15-OSC32_OUT)* 27(PB4)* 28(PB5)*

### Buses and harness runs
harness I2C = port I2C
harness SPI = port SPI

### Notes on the sheet
- 8

### Library data of the parts
C9 C10 = Cap: Capacitor; Published: 8-Jun-2000; LatestRevisionDate: 17-Jul-2002; LatestRevisionNote: Re-released for DXP Platform.; PackageReference: RAD-0.3; Publisher: Altium Limited; PackageDescription: Radial Cap, Thru-Hole; 2 Leads; 0.3 in Pin Spacing
D1 = LED3: Typical BLUE SiC LED; Published: 8-Jun-2000; LatestRevisionDate: 17-Dec-2003; LatestRevisionNote: PCB Footprint replaced.; DatasheetVersion: 16-Apr-2002; PackageVersion: 16-Apr-2002; PackageReference: 3.5X2.8X1.9; Publisher: Altium Limited; PackageDescription: SM LED; 2 C-Bend Leads; Body 3.5 x 2.8 x 1.9 mm, inc leads (LxWxH typ)
IC8 = STM32L031K6T6: Integrated Circuit; Manufacturer_Name: STMicroelectronics; Datasheet Link: https://www.st.com/resource/en/datasheet/stm32l031k6.pdf; Height: 1.6mm; Manufacturer_Part_Number: STM32L031K6T6; Arrow Part Number: STM32L031K6T6; Arrow Price/Stock: https://www.arrow.com/en/products/stm32l031k6t6/stmicroelectronics; Mouser Part Number: 511-STM32L031K6T6; Mouser Price/Stock: https://www.mouser.co.uk/ProductDetail/STMicroelectronics/STM32L031K6T6?qs=mwoc%252BQmZlGIAMyWzQ3GanA%3D%3D
P2 = Header 2X2: Header, 2-Pin, Dual row; LatestRevisionDate: 17-Jul-2002; LatestRevisionNote: Re-released for DXP Platform.; Publisher: Altium Limited
R3 R4 R8 = Res3: Resistor; Published: 8-Jun-2000; LatestRevisionDate: 29-May-2009; LatestRevisionNote: IPC-7351 Footprint Added.; PackageReference: J1-0603; Publisher: Altium Limited; PackageDescription: Chip Resistor

## Sheet GPS.SchDoc: GPS module
size A4
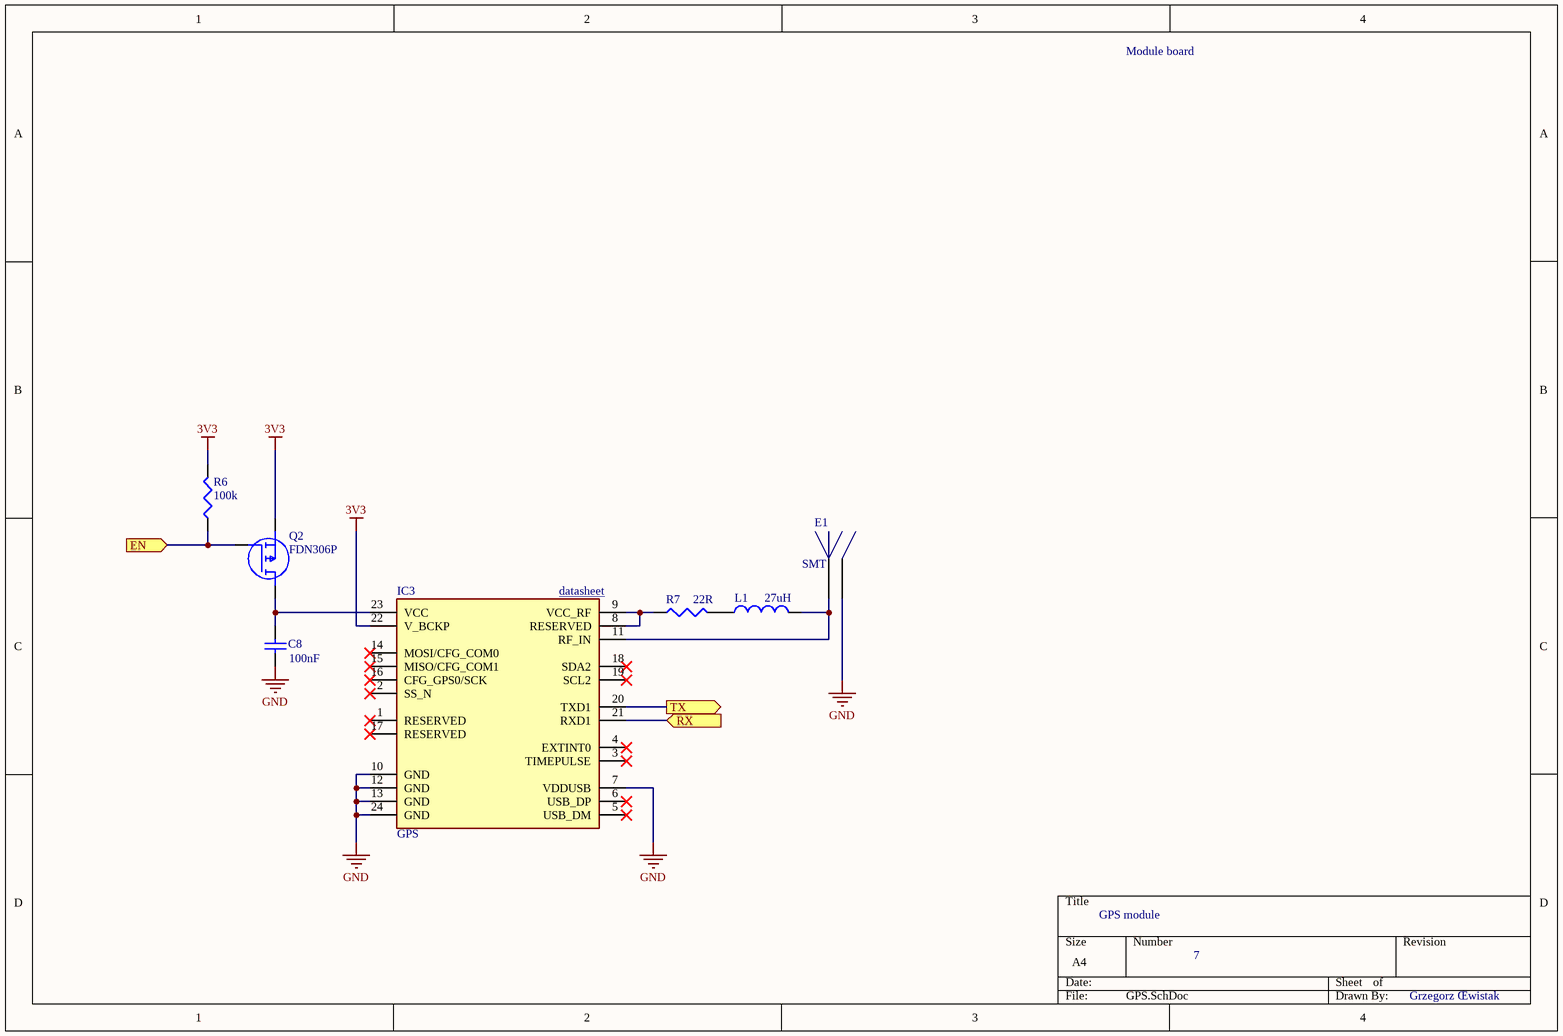
[diagram p8: GPS.SchDoc]

### Parts
C8  value 100nF  [C0805]  (hidden comment: Cap)
E1  SMT  [UFLRSMT160]
IC3  GPS  [NEO6M0001_only_used_pins]
L1  value 27uH  [L-0805]  (hidden comment: Inductor)
Q2  FDN306P  [SOT95P237X112-3N]
R6  value 100k  [R0603]  (hidden comment: Res3)
R7  value 22R  [R0603]

### Ports
EN (in), RX (in), TX (out)

### Nets
3V3: IC3.22(V_BCKP) Q2.2(S) R6.2
GND: C8.1 E1.2(GND) IC3.7(VDDUSB) IC3.10(GND) IC3.12(GND) IC3.13(GND) IC3.24(GND)
NetC8_2: C8.2 IC3.23(VCC) Q2.3(D)
NetE1_1: E1.1(SIG) IC3.11(RF_IN) L1.2
NetIC3_8: IC3.8(RESERVED) IC3.9(VCC_RF) R7.1
NetIC3_20: IC3.20(TXD1) ; port TX
NetIC3_21: IC3.21(RXD1) ; port RX
NetIC8_7: Q2.1(G) R6.1 ; port EN
NetL1_1: L1.1 R7.2

Not connected (* = marked no-connect by the designer): IC3 1(RESERVED)* 2(SS_N)* 3(TIMEPULSE)* 4(EXTINT0)* 5(USB_DM)* 6(USB_DP)* 14(MOSI/CFG_COM0)* 15(MISO/CFG_COM1)* 16(CFG_GPS0/SCK)* 17(RESERVED)* 18(SDA2)* 19(SCL2)*

### Notes on the sheet
- Module board
- (near IC3) datasheet <https://download.kamami.pl/p563067-NEO-6_DataSheet_%28GPS.G6-HW-09005%29.pdf>
- 7

### Library data of the parts
C8 = Cap: Capacitor; Published: 8-Jun-2000; LatestRevisionDate: 17-Jul-2002; LatestRevisionNote: Re-released for DXP Platform.; PackageReference: RAD-0.3; Publisher: Altium Limited; PackageDescription: Radial Cap, Thru-Hole; 2 Leads; 0.3 in Pin Spacing
E1 = SMT_antenne
IC3 = NEO-6M-0-001: GPS modle; Manufacturer_Name: U-Blox; Datasheet Link: https://www.u-blox.com/sites/default/files/products/documents/NEO-6_DataSheet_%28GPS.G6-HW-09005%29.pdf; Height: 2.6mm; Manufacturer_Part_Number: NEO-6M-0-001; Arrow Part Number: NEO-6M-0-001
L1 = Inductor: Code_IEC: 1005; Published: 8-Jun-2000; LatestRevisionDate: 29-May-2009; LatestRevisionNote: IPC-7351 Footprint Added.; PackageReference: 0402-A; Publisher: Altium Limited; PackageDescription: Chip Inductor; Code_JEITA: 0402
Q2 = FDN306P: as Q1 on sheet bluetooth; Datasheet Link: http://uk.rs-online.com/web/p/products/1241702; Height: 1.12mm; Manufacturer_Part_Number: FDN306P; Arrow Part Number: FDN306P; Arrow Price/Stock: https://www.arrow.com/en/products/fdn306p/on-semiconductor; Mouser Part Number: 512-FDN306P; Mouser Price/Stock: https://www.mouser.co.uk/ProductDetail/ON-Semiconductor-Fairchild/FDN306P?qs=GeD7q9OHBPy9Kkc110idSQ%3D%3D
R6 R7 = Res3: Resistor; Published: 8-Jun-2000; LatestRevisionDate: 29-May-2009; LatestRevisionNote: IPC-7351 Footprint Added.; PackageReference: J1-0603; Publisher: Altium Limited; PackageDescription: Chip Resistor

## Sheet wyswietlacz.SchDoc: Oled display
size A4
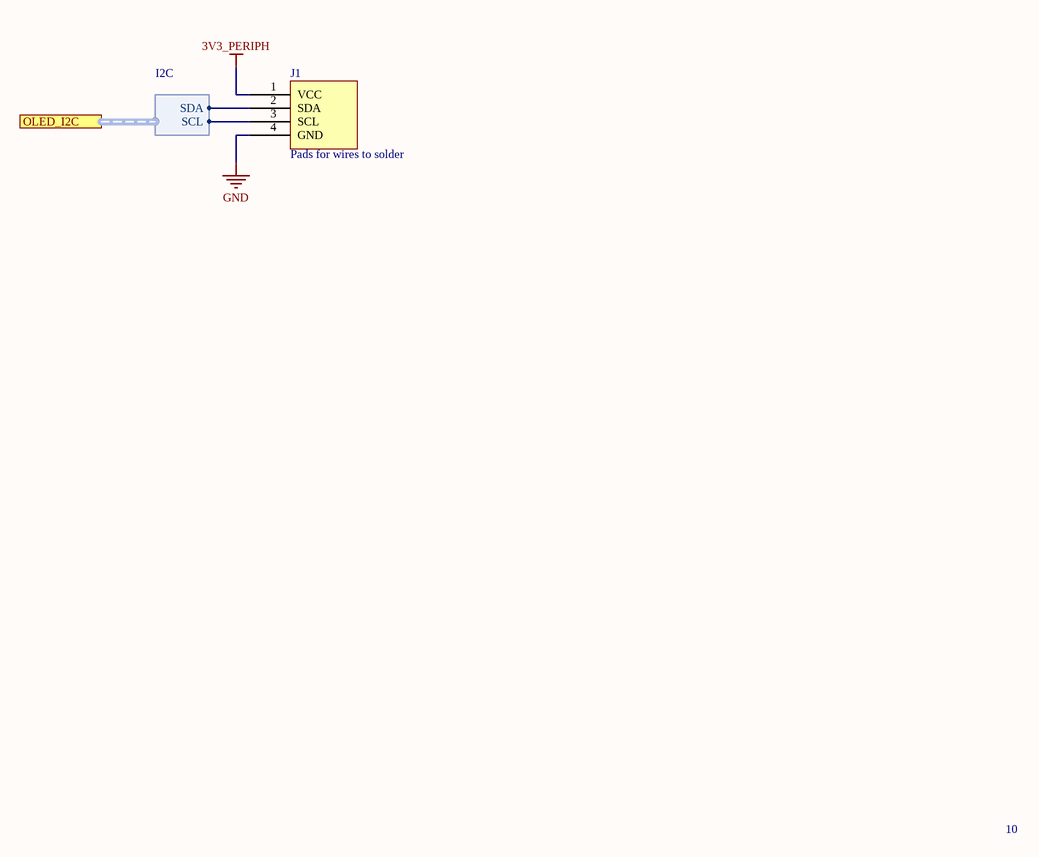
[diagram p9: wyswietlacz.SchDoc]

### Parts
J1  Pads for wires to solder  [OLED_PAD]

### Ports
OLED_I2C (harness I2C)

### Harnesses
I2C: SCL, SDA

### Nets
3V3_PERIPH: J1.1(VCC)
GND: J1.4(GND)
I2C.SCL: J1.3(SCL) ; port OLED_I2C.SCL
I2C.SDA: J1.2(SDA) ; port OLED_I2C.SDA

### Notes on the sheet
- 10

### Library data of the parts
J1 = OLED_connector

## Nets that join several sheets
3V3: bluetooth (Q1.2 R1.2), czujnik_dotyku (C7.2 IC2.5), zasilanie (5 pins), mikrokontroler (6 pins), GPS (IC3.22 Q2.2 R6.2)
3V3_PERIPH: czujnik_tetna (6 pins), akcelerometr (U2.1 U2.14), pamiec_zewnetrzna (C11.2 IC4.3 IC4.7 IC4.8), zasilanie (C16.2 Q3.3), wyswietlacz (J1.1)
GND: bluetooth (C2.1 U3.13 U3.21 U3.22), czujnik_tetna (6 pins), akcelerometr (5 pins), pamiec_zewnetrzna (C11.1 IC4.4), czujnik_dotyku (C7.1 IC2.2 IC2.6), zasilanie (18 pins), mikrokontroler (7 pins), GPS (7 pins), wyswietlacz (J1.4)
I2C.SCL: czujnik_tetna (IC1.3), akcelerometr (U2.4), mikrokontroler (R3.1), wyswietlacz (J1.3)
I2C.SDA: czujnik_tetna (IC1.2), akcelerometr (U2.6), mikrokontroler (R4.1), wyswietlacz (J1.2)
NetC12_2: zasilanie (C12.2 R11.2 R13.1), mikrokontroler (IC8.14)
NetIC1_13: czujnik_tetna (IC1.13), mikrokontroler (IC8.18)
NetIC2_1: czujnik_dotyku (IC2.1), mikrokontroler (IC8.6)
NetIC3_20: mikrokontroler (IC8.9), GPS (IC3.20)
NetIC3_21: mikrokontroler (IC8.8), GPS (IC3.21)
NetIC5_1: zasilanie (IC5.1), mikrokontroler (IC8.21)
NetIC8_7: mikrokontroler (IC8.7), GPS (Q2.1 R6.1)
NetIC8_15: akcelerometr (U2.11), mikrokontroler (IC8.15)
NetIC8_22: zasilanie (Q3.1 R12.1), mikrokontroler (IC8.22)
NetIC8_26: bluetooth (Q1.1 R1.1), mikrokontroler (IC8.26)
NetIC8_29: bluetooth (U3.2), mikrokontroler (IC8.29)
NetIC8_30: bluetooth (U3.1), mikrokontroler (IC8.30)